# Altium schematic sheet GPS.SchDoc
size A4; Author: Author; CompanyName: AGH Racing; DocumentNumber: 2; Revision: Rev; SheetNumber: 3; SheetTotal: 8; CarNumber: 5; ProjectName: Project Name
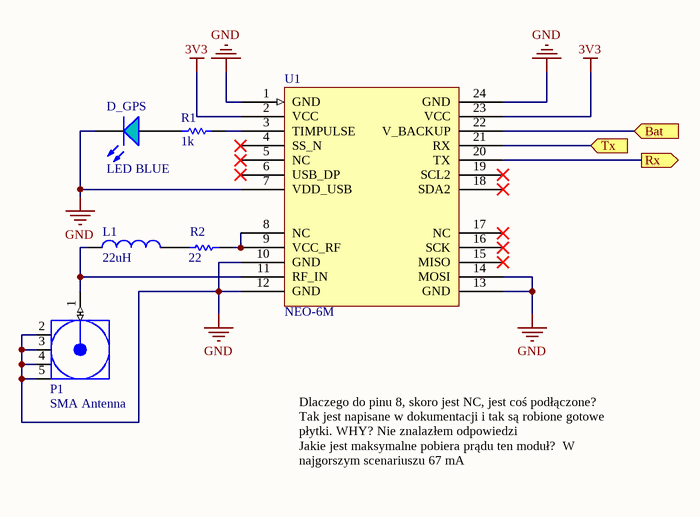
[diagram p0: GPS.SchDoc]

## Parts
D_GPS  LED BLUE  [KPA_2106]
L1  value 22uH  [IND_0603_IPC_HD]  (hidden comment: Ind)
P1  SMA Antenna  [SMA_PCB_Female_Angle_connector]
R1  value 1k  [RES_0603_IPC_HD]  (hidden comment: Res)
R2  value 22  [RES_0603_IPC_HD]  (hidden comment: Res)
U1  NEO-6M  [NEO-6M]

## Ports
Bat (in), Rx (out), Tx (in)

## Nets
3V3: U1.2(VCC) U1.23(VCC)
GND: D_GPS.2(K) P1.2(GND) P1.3(GND) P1.4(GND) P1.5(GND) U1.1(GND) U1.7(VDD_USB) U1.10(GND) U1.12(GND) U1.13(GND) U1.14(MOSI) U1.24(GND)
Bat: U1.22(V_BACKUP) ; port Bat
Rx: U1.20(TX) ; port Rx
Tx: U1.21(RX) ; port Tx
NetD_GPS_1: D_GPS.1(A) R1.1
NetL1_1: L1.1 P1.1(Signal) U1.11(RF_IN)
NetL1_2: L1.2 R2.1
NetR1_2: R1.2 U1.3(TIMPULSE)
NetR2_2: R2.2 U1.8(NC) U1.9(VCC_RF)

Not connected (* = marked no-connect by the designer): U1 4(SS_N)* 5(NC)* 6(USB_DP)* 15(MISO)* 16(SCK)* 17(NC)* 18(SDA2)* 19(SCL2)*

## Notes on the sheet
- Dlaczego do pinu 8, skoro jest NC, jest coś podłączone? Tak jest napisane w dokumentacji i tak są robione gotowe płytki. WHY? Nie znalazłem odpowiedzi
  Jakie jest maksymalne pobiera prądu ten moduł?  W najgorszym scenariuszu 67 mA
- Confidential / Not for distribution !
- Project name:
- Document name:
- Sheet:
- Car No.
- of
- Designer Name:
- Date/Time:
- Revision:

## Library data of the parts
L1 = Ind: Inductor
P1 = SMA PCB Female Antenna Angle connector: Gniazdo; SMA; żeńskie; kątowe 90°; 50Ω; THT; na PCB; teflon; złocony; Manufaturer: TE CONNECTIVITY; Manufacturer Symbol: 5-1814400-1; Supplier: TME; Supplier Symbol: 5-1814400-1
R1 R2 = Res: Resistor